# EAGLE design PCB-BI8-2x5RGB-SE-VC (EAGLE 7.1.0)

## Sheet 1 of 2
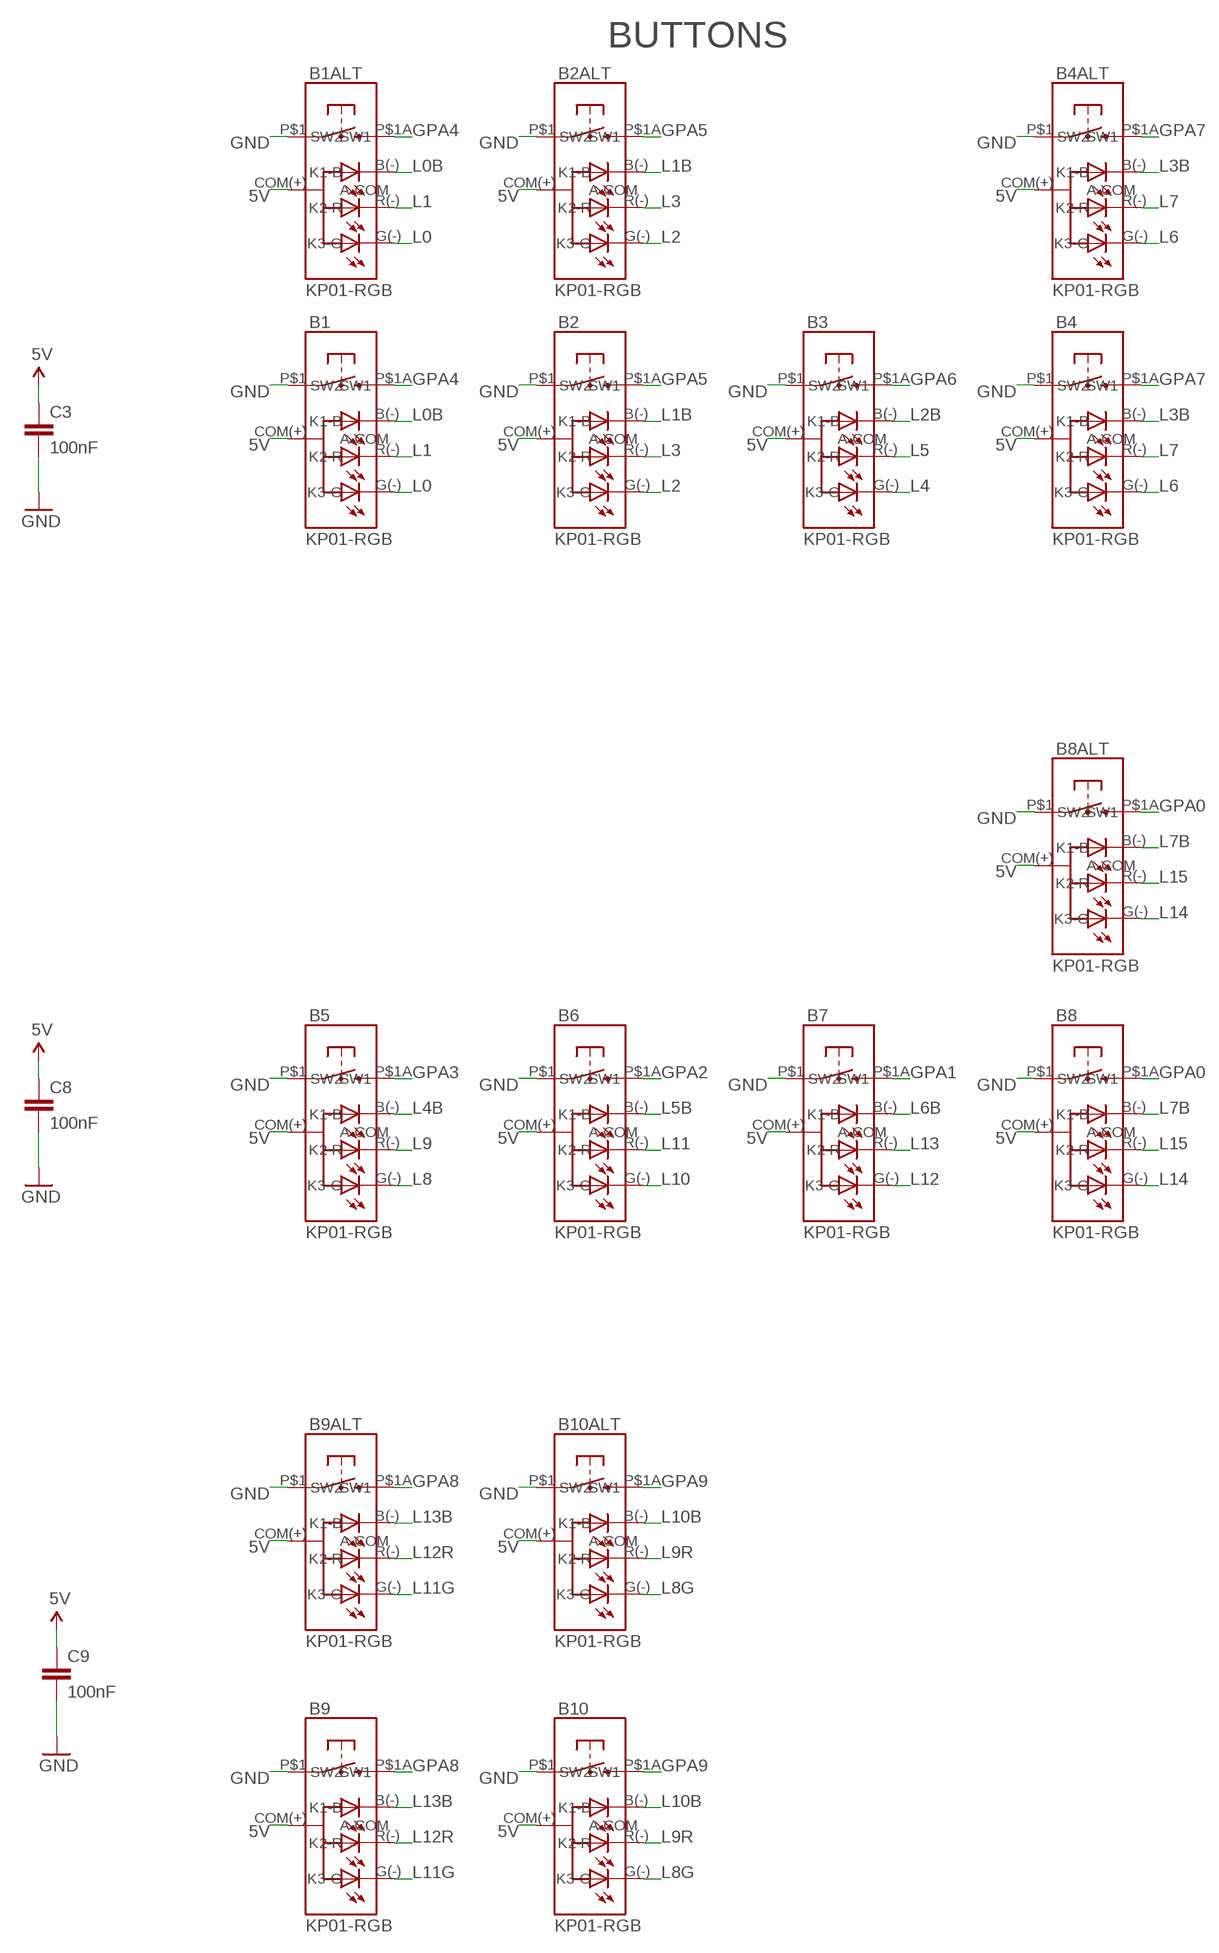
[diagram p0: schematic, sheet 1, part 1 of 2]
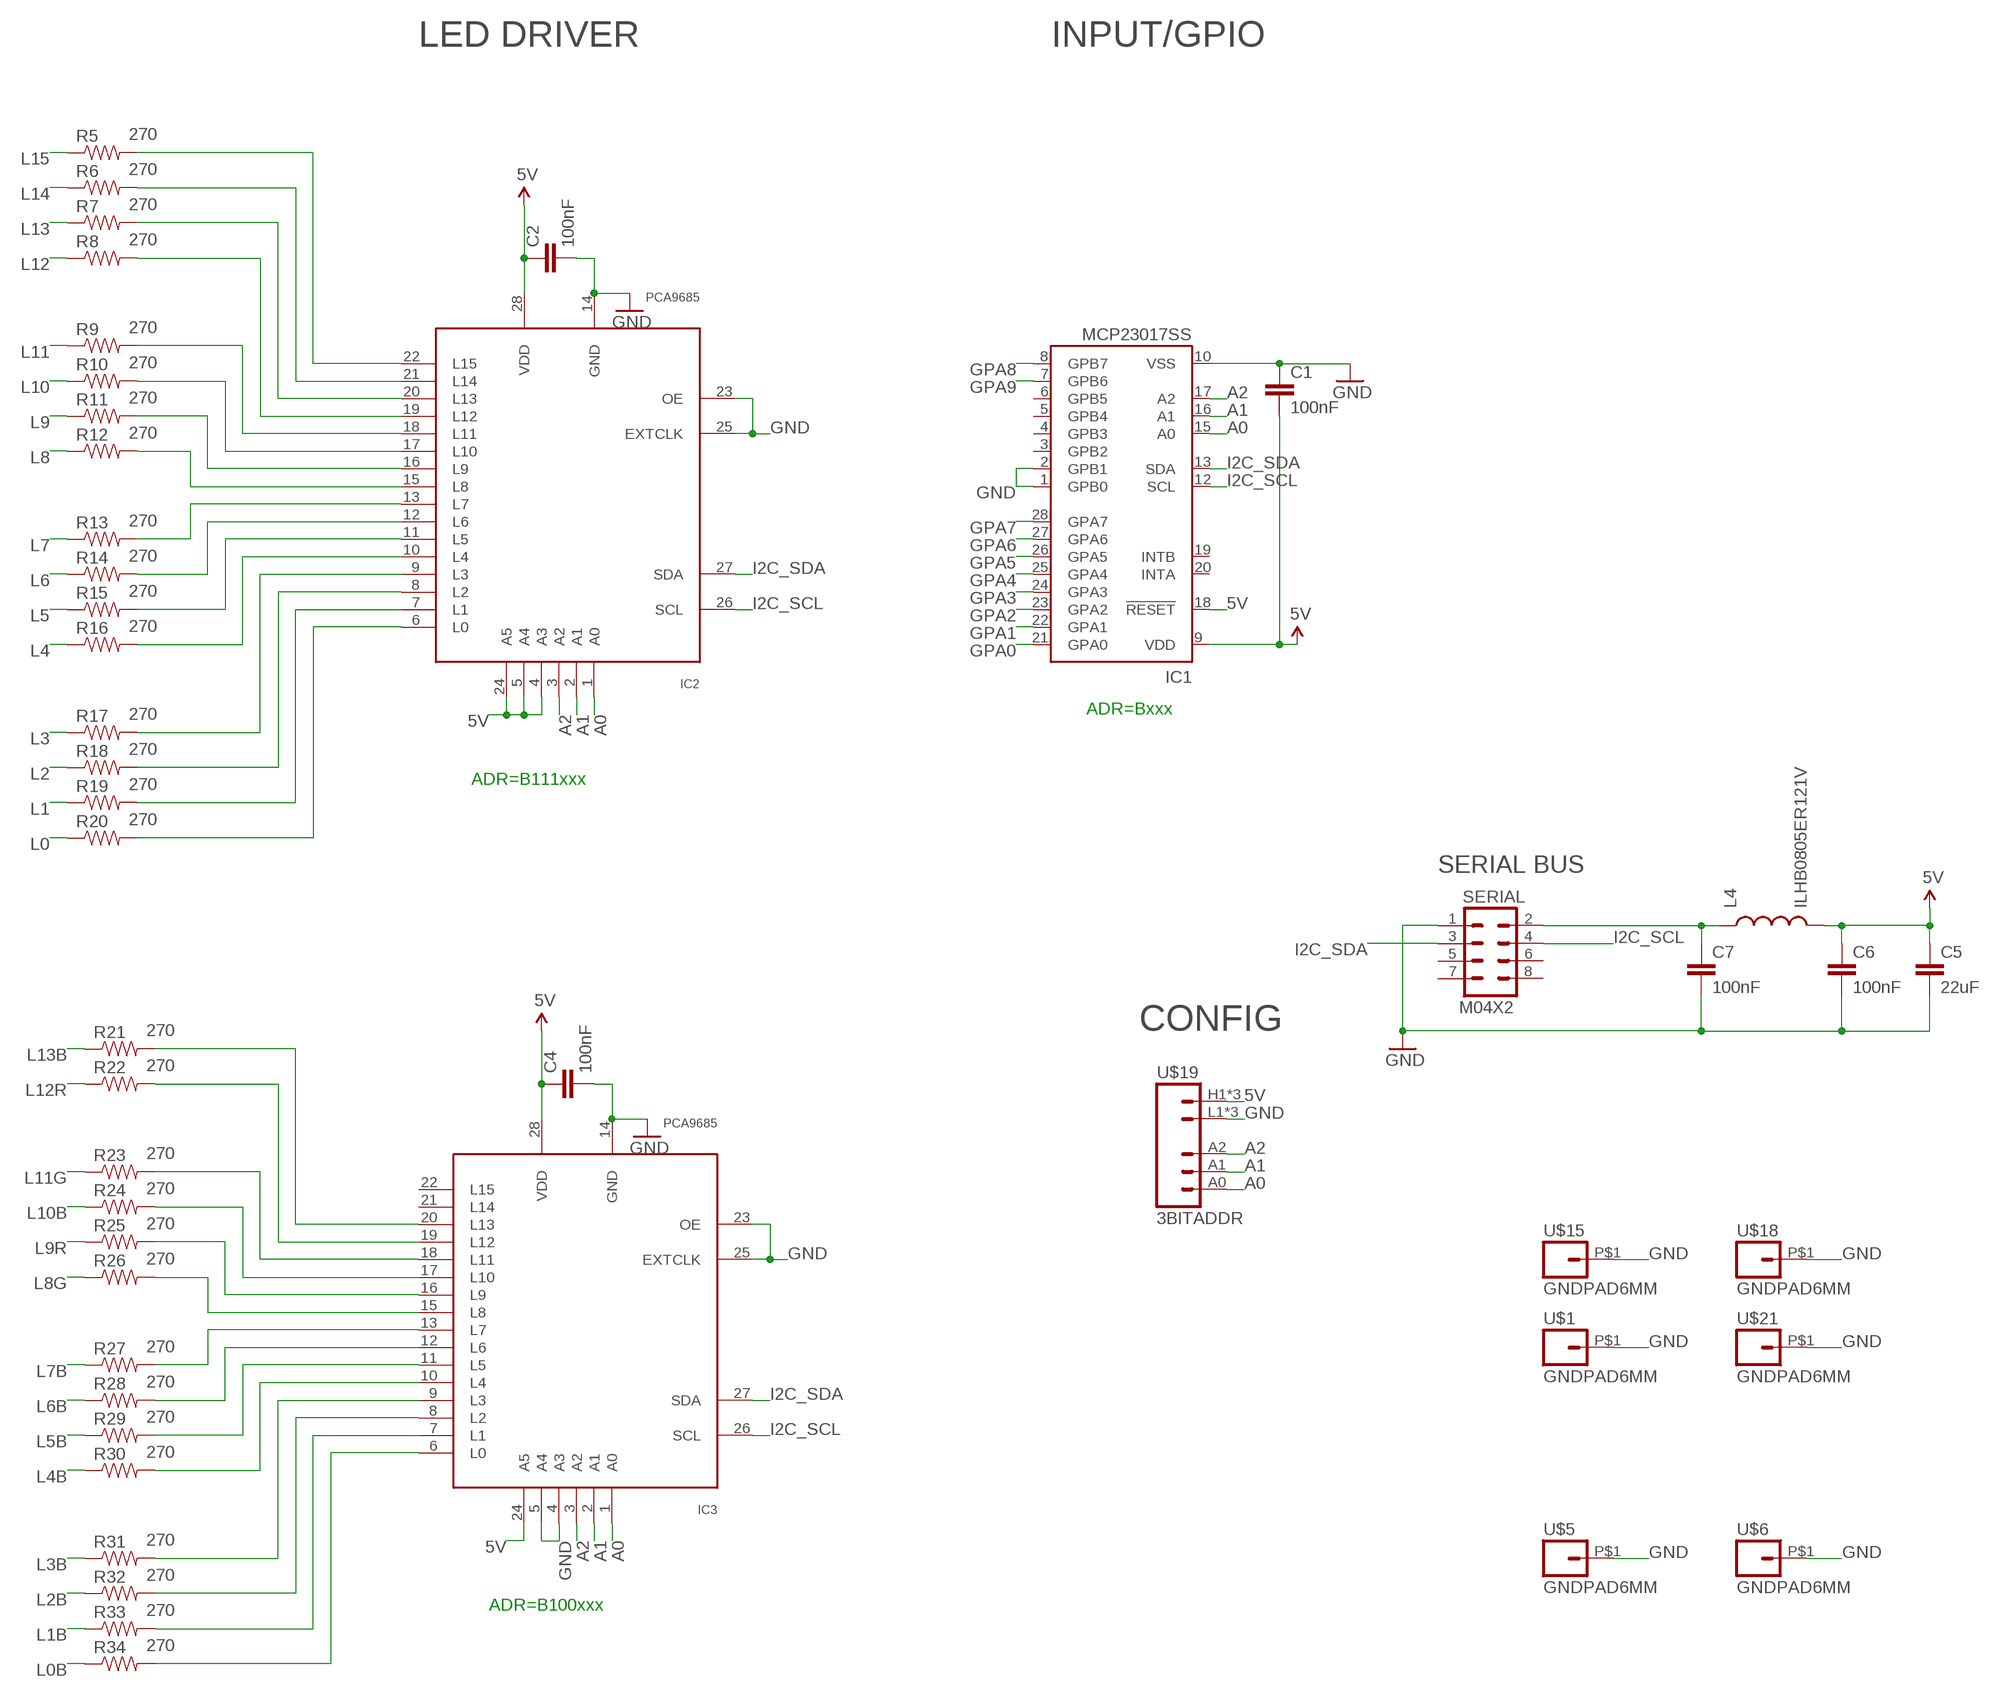
[diagram p1: schematic, sheet 1, part 2 of 2]

### Parts
B1  KP01-RGB  NKK-KP01  [NKK-KP01]
B1ALT  KP01-RGB  NKK-KP01  [NKK-KP01]
B2  KP01-RGB  NKK-KP01  [NKK-KP01]
B2ALT  KP01-RGB  NKK-KP01  [NKK-KP01]
B3  KP01-RGB  NKK-KP01  [NKK-KP01]
B4  KP01-RGB  NKK-KP01  [NKK-KP01]
B4ALT  KP01-RGB  NKK-KP01  [NKK-KP01]
B5  KP01-RGB  NKK-KP01  [NKK-KP01]
B6  KP01-RGB  NKK-KP01  [NKK-KP01]
B7  KP01-RGB  NKK-KP01  [NKK-KP01]
B8  KP01-RGB  NKK-KP01  [NKK-KP01]
B8ALT  KP01-RGB  NKK-KP01  [NKK-KP01]
B9  KP01-RGB  NKK-KP01  [NKK-KP01]
B9ALT  KP01-RGB  NKK-KP01  [NKK-KP01]
B10  KP01-RGB  NKK-KP01  [NKK-KP01]
B10ALT  KP01-RGB  NKK-KP01  [NKK-KP01]
C1  100nF  CAP0603-CAP  [0603-CAP]
C2  100nF  CAP0603-CAP  [0603-CAP]
C3  100nF  CAP0603-CAP  [0603-CAP]
C4  100nF  CAP0603-CAP  [0603-CAP]
C5  22uF  CAP0805  [0805]
C6  100nF  CAP0603-CAP  [0603-CAP]
C7  100nF  CAP0603-CAP  [0603-CAP]
C8  100nF  CAP0603-CAP  [0603-CAP]
C9  100nF  CAP0603-CAP  [0603-CAP]
IC1  MCP23017SS  [SSOP28]
IC2  PCA9685  [TSSOP28]
IC3  PCA9685  [TSSOP28]
L4  ILHB0805ER121V  INDUCTOR0805  [0805]
R5  270  RESISTOR0603-RES  [0603-RES]
R6  270  RESISTOR0603-RES  [0603-RES]
R7  270  RESISTOR0603-RES  [0603-RES]
R8  270  RESISTOR0603-RES  [0603-RES]
R9  270  RESISTOR0603-RES  [0603-RES]
R10  270  RESISTOR0603-RES  [0603-RES]
R11  270  RESISTOR0603-RES  [0603-RES]
R12  270  RESISTOR0603-RES  [0603-RES]
R13  270  RESISTOR0603-RES  [0603-RES]
R14  270  RESISTOR0603-RES  [0603-RES]
R15  270  RESISTOR0603-RES  [0603-RES]
R16  270  RESISTOR0603-RES  [0603-RES]
R17  270  RESISTOR0603-RES  [0603-RES]
R18  270  RESISTOR0603-RES  [0603-RES]
R19  270  RESISTOR0603-RES  [0603-RES]
R20  270  RESISTOR0603-RES  [0603-RES]
R21  270  RESISTOR0603-RES  [0603-RES]
R22  270  RESISTOR0603-RES  [0603-RES]
R23  270  RESISTOR0603-RES  [0603-RES]
R24  270  RESISTOR0603-RES  [0603-RES]
R25  270  RESISTOR0603-RES  [0603-RES]
R26  270  RESISTOR0603-RES  [0603-RES]
R27  270  RESISTOR0603-RES  [0603-RES]
R28  270  RESISTOR0603-RES  [0603-RES]
R29  270  RESISTOR0603-RES  [0603-RES]
R30  270  RESISTOR0603-RES  [0603-RES]
R31  270  RESISTOR0603-RES  [0603-RES]
R32  270  RESISTOR0603-RES  [0603-RES]
R33  270  RESISTOR0603-RES  [0603-RES]
R34  270  RESISTOR0603-RES  [0603-RES]
SERIAL  M04X2  [2X4]
U$1  GNDPAD6MM  [3.2MMPAD6MM]
U$5  GNDPAD6MM  [3.2MMPAD6MM]
U$6  GNDPAD6MM  [3.2MMPAD6MM]
U$15  GNDPAD6MM  [3.2MMPAD6MM]
U$18  GNDPAD6MM  [3.2MMPAD6MM]
U$19  3BITADDR  [3BITADDR]
U$21  GNDPAD6MM  [3.2MMPAD6MM]

### Nets
5V [Power]: B1.COM(+)(A-COM) B1ALT.COM(+)(A-COM) B2.COM(+)(A-COM) B2ALT.COM(+)(A-COM) B3.COM(+)(A-COM) B4.COM(+)(A-COM) B4ALT.COM(+)(A-COM) B5.COM(+)(A-COM) B6.COM(+)(A-COM) B7.COM(+)(A-COM) B8.COM(+)(A-COM) B8ALT.COM(+)(A-COM) B9.COM(+)(A-COM) B9ALT.COM(+)(A-COM) B10.COM(+)(A-COM) B10ALT.COM(+)(A-COM) C1.2 C2.1 C3.1 C4.1 C5.1 C6.1 C8.1 C9.1 IC1.9(VDD) IC1.18(!RESET) IC2.4(A3) IC2.5(A4) IC2.24(A5) IC2.28(VDD) IC3.24(A5) IC3.28(VDD) L4.2 U$19.H1(VCC) U$19.H2(VCC) U$19.H3(VCC)
A0: IC1.15(A0) IC2.1(A0) IC3.1(A0) U$19.A0
A1: IC1.16(A1) IC2.2(A1) IC3.2(A1) U$19.A1
A2: IC1.17(A2) IC2.3(A2) IC3.3(A2) U$19.A2
GND [Power]: B1.P$1(SW1) B1ALT.P$1(SW1) B2.P$1(SW1) B2ALT.P$1(SW1) B3.P$1(SW1) B4.P$1(SW1) B4ALT.P$1(SW1) B5.P$1(SW1) B6.P$1(SW1) B7.P$1(SW1) B8.P$1(SW1) B8ALT.P$1(SW1) B9.P$1(SW1) B9ALT.P$1(SW1) B10.P$1(SW1) B10ALT.P$1(SW1) C1.1 C2.2 C3.2 C4.2 C5.2 C6.2 C7.2 C8.2 C9.2 IC1.1(GPB0) IC1.2(GPB1) IC1.10(VSS) IC2.14(GND) IC2.23(OE) IC2.25(EXTCLK) IC3.4(A3) IC3.5(A4) IC3.14(GND) IC3.23(OE) IC3.25(EXTCLK) SERIAL.1 U$1.P$1 U$5.P$1 U$6.P$1 U$15.P$1 U$18.P$1 U$19.L1(GND) U$19.L2(GND) U$19.L3(GND) U$21.P$1
GPA0: B8.P$1A(SW2) B8ALT.P$1A(SW2) IC1.21(GPA0)
GPA1: B7.P$1A(SW2) IC1.22(GPA1)
GPA2: B6.P$1A(SW2) IC1.23(GPA2)
GPA3: B5.P$1A(SW2) IC1.24(GPA3)
GPA4: B1.P$1A(SW2) B1ALT.P$1A(SW2) IC1.25(GPA4)
GPA5: B2.P$1A(SW2) B2ALT.P$1A(SW2) IC1.26(GPA5)
GPA6: B3.P$1A(SW2) IC1.27(GPA6)
GPA7: B4.P$1A(SW2) B4ALT.P$1A(SW2) IC1.28(GPA7)
GPA8: B9.P$1A(SW2) B9ALT.P$1A(SW2) IC1.8(GPB7)
GPA9: B10.P$1A(SW2) B10ALT.P$1A(SW2) IC1.7(GPB6)
I2C_SCL: IC1.12(SCL) IC2.26(SCL) IC3.26(SCL) SERIAL.4
I2C_SDA: IC1.13(SDA) IC2.27(SDA) IC3.27(SDA) SERIAL.3
L0: B1.G(-)(K3-G) B1ALT.G(-)(K3-G) R20.1
L0B: B1.B(-)(K1-B) B1ALT.B(-)(K1-B) R34.1
L1: B1.R(-)(K2-R) B1ALT.R(-)(K2-R) R19.1
L1B: B2.B(-)(K1-B) B2ALT.B(-)(K1-B) R33.1
L2: B2.G(-)(K3-G) B2ALT.G(-)(K3-G) R18.1
L2B: B3.B(-)(K1-B) R32.1
L3: B2.R(-)(K2-R) B2ALT.R(-)(K2-R) R17.1
L3B: B4.B(-)(K1-B) B4ALT.B(-)(K1-B) R31.1
L4: B3.G(-)(K3-G) R16.1
L4B: B5.B(-)(K1-B) R30.1
L5: B3.R(-)(K2-R) R15.1
L5B: B6.B(-)(K1-B) R29.1
L6: B4.G(-)(K3-G) B4ALT.G(-)(K3-G) R14.1
L6B: B7.B(-)(K1-B) R28.1
L7: B4.R(-)(K2-R) B4ALT.R(-)(K2-R) R13.1
L7B: B8.B(-)(K1-B) B8ALT.B(-)(K1-B) R27.1
L8: B5.G(-)(K3-G) R12.1
L8G: B10.G(-)(K3-G) B10ALT.G(-)(K3-G) R26.1
L9: B5.R(-)(K2-R) R11.1
L9R: B10.R(-)(K2-R) B10ALT.R(-)(K2-R) R25.1
L10: B6.G(-)(K3-G) R10.1
L10B: B10.B(-)(K1-B) B10ALT.B(-)(K1-B) R24.1
L11: B6.R(-)(K2-R) R9.1
L11G: B9.G(-)(K3-G) B9ALT.G(-)(K3-G) R23.1
L12: B7.G(-)(K3-G) R8.1
L12R: B9.R(-)(K2-R) B9ALT.R(-)(K2-R) R22.1
L13: B7.R(-)(K2-R) R7.1
L13B: B9.B(-)(K1-B) B9ALT.B(-)(K1-B) R21.1
L14: B8.G(-)(K3-G) B8ALT.G(-)(K3-G) R6.1
L15: B8.R(-)(K2-R) B8ALT.R(-)(K2-R) R5.1
N$1 [Power]: C7.1 L4.1 SERIAL.2
N$2: IC3.13(L7) R27.2
N$3: IC3.12(L6) R28.2
N$4: IC2.13(L7) R13.2
N$5: IC2.12(L6) R14.2
N$6: IC3.11(L5) R29.2
N$7: IC2.11(L5) R15.2
N$9: IC2.10(L4) R16.2
N$10: IC2.9(L3) R17.2
N$11: IC2.8(L2) R18.2
N$12: IC2.7(L1) R19.2
N$13: IC3.10(L4) R30.2
N$14: IC3.9(L3) R31.2
N$15: IC3.8(L2) R32.2
N$16: IC3.7(L1) R33.2
N$17: IC3.6(L0) R34.2
N$18: IC3.15(L8) R26.2
N$19: IC2.6(L0) R20.2
N$20: IC2.15(L8) R12.2
N$21: IC2.16(L9) R11.2
N$22: IC2.17(L10) R10.2
N$23: IC2.18(L11) R9.2
N$24: IC2.19(L12) R8.2
N$25: IC2.20(L13) R7.2
N$26: IC2.21(L14) R6.2
N$27: IC2.22(L15) R5.2
N$28: IC3.16(L9) R25.2
N$29: IC3.17(L10) R24.2
N$30: IC3.18(L11) R23.2
N$31: IC3.19(L12) R22.2
N$32: IC3.20(L13) R21.2
Unconnected: IC1.3(GPB2) IC1.4(GPB3) IC1.5(GPB4) IC1.6(GPB5) IC1.19(INTB) IC1.20(INTA) IC3.21(L14) IC3.22(L15) SERIAL.5 SERIAL.6 SERIAL.7 SERIAL.8

### Notes on the sheet
- BUTTONS | LED DRIVER | INPUT/GPIO
- ADR=Bxxx
- ADR=B111xxx
- SERIAL BUS
- CONFIG
- ADR=B100xxx

## Sheet 2 of 2

## Library data of the parts
B1 B1ALT B2 B2ALT B3 B4 B4ALT B5-B8 B8ALT B9 B9ALT B10 B10ALT = SKAARHOJ:NKK-KP01: NKK-KP01-15AC 100mA12VDC
C1-C9 = SparkFun:CAP: Capacitor Standard 0603 ceramic capacitor, and 0.1" leaded capacitor.
IC1 = microchip:MCP23017: http://ww1.microchip.com/downloads/en/DeviceDoc/21952a.pdf Source: http://ww1.microchip.com/downloads/en/DeviceDoc/21952a.pdf; MF: MICROCHIP; MPN: MCP23017-E/SS; OC_FARNELL: 1467674; OC_NEWARK: 31K2960
IC2 IC3 = wsmith:PCA9685
L4 = SparkFun:INDUCTOR: Inductors Basic Inductor/Choke - 0603 and 1206. Footprints are not proven and vary greatly between part numbers.
R5-R34 = SparkFun:RESISTOR: Resistor Basic schematic elements and footprints for 0603, 1206, and PTH resistors.
SERIAL = SparkFun:M04X2
U$1 U$5 U$6 U$15 U$18 U$21 = SKAARHOJ:GNDPAD
U$19 = SKAARHOJ:3BITADDR

## Net classes
0 default: width 0.203 mm, drill 0.254 mm, clearance 0.203 mm
1 Power: width 0.406 mm, drill 0.61 mm, clearance 0.203 mm

## Board
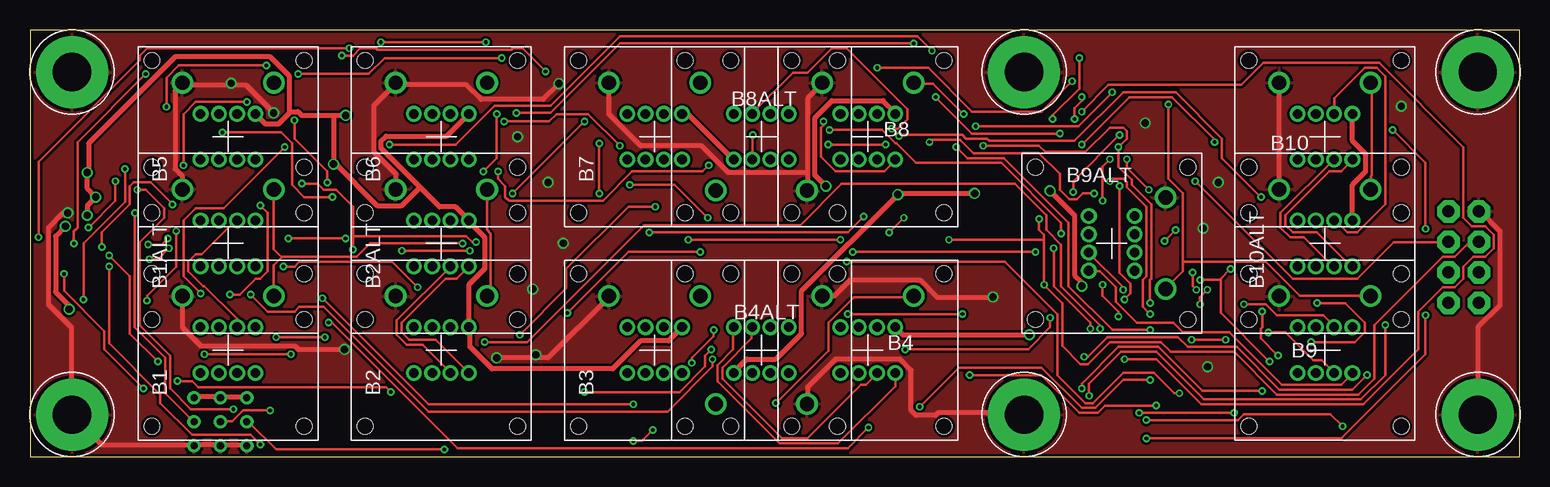
[diagram p2: board, top side]
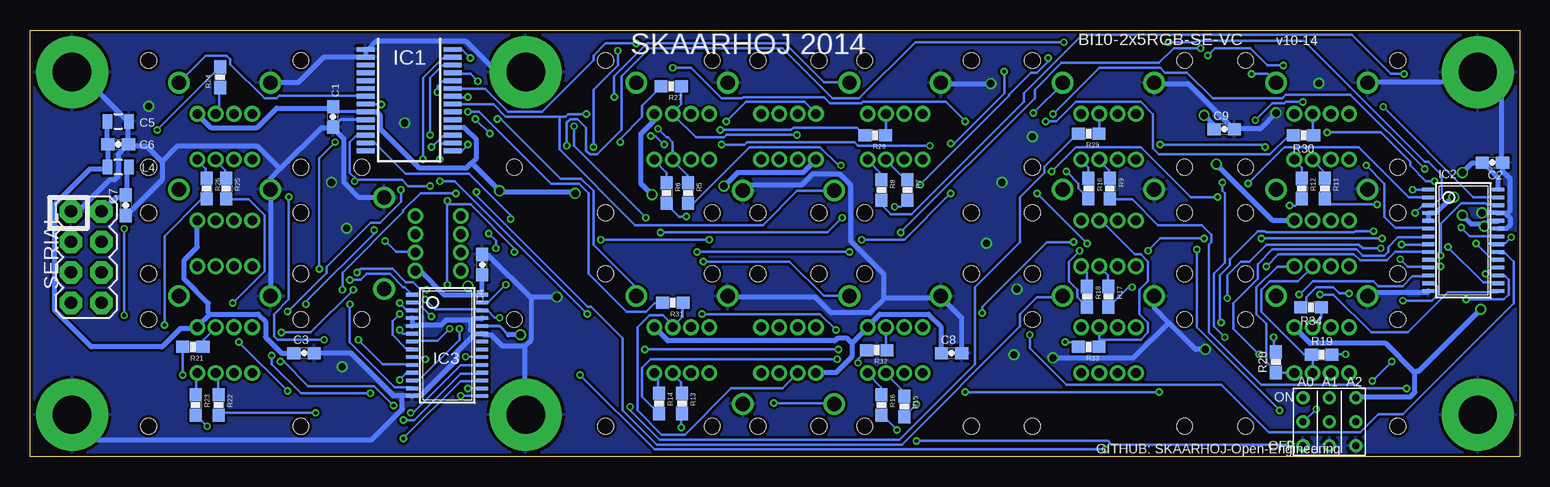
[diagram p3: board, bottom side, seen from below]

Size 124.19 x 35.56 mm. Coordinates in mm from the lower left corner, seen from the top.
Outline: 0,0 124.19,0 124.19,35.56 0,35.56 0,0
Copper layers (1*16): Top 0.035mm / dielectric 1.5mm / Bottom 0.035mm
Design rules "Fusion_eagle_rule_v1.1": minimum track width 6mil, minimum drill 12mil, track to track 6mil, track to pad 6mil, pad to pad 6mil, via to via 6mil, smd to smd 0mil, copper to edge 10mil, drill to drill 10mil, minimum pad ring 10mil, minimum via ring 6mil, stop-mask expansion 2mil, vias tented up to drill 100mil, thermal gap 10mil

### Footprints (pad centres in the part's own frame; a part is rotated, then mirrored left to right if it is on the bottom)
NKK-KP01 = drill 0.8: B(-) 1.905,-0.762; COM(+) 1.905,-2.286; G(-) -1.905,-2.286; P$3 1.905,0.762; P$4 1.905,2.286; P$7 -1.905,0.762; P$8 -1.905,2.286; R(-) -1.905,-0.762 | drill 1.2: P$1 4.496,3.81; P$1A 4.496,-3.81 | hole 1.3: -6.35,6.35; 6.35,6.35; 6.35,-6.35; -6.35,-6.35
0603-CAP = smd 1.1 x 1: 1 -0.85,0; 2 0.85,0
0805 = smd 0.8 x 1.2: 1 -0.9,0; 2 0.9,0
SSOP28 = smd 0.4 x 1.5: 1 -4.225,-3.625; 2 -3.575,-3.625; 3 -2.925,-3.625; 4 -2.275,-3.625; 5 -1.625,-3.625; 6 -0.975,-3.625; 7 -0.325,-3.625; 8 0.325,-3.625; 9 0.975,-3.625; 10 1.625,-3.625; 11 2.275,-3.625; 12 2.925,-3.625; 13 3.575,-3.625; 14 4.225,-3.625; 15 4.225,3.625; 16 3.575,3.625; 17 2.925,3.625; 18 2.275,3.625; 19 1.625,3.625; 20 0.975,3.625; 21 0.325,3.625; 22 -0.325,3.625; 23 -0.975,3.625; 24 -1.625,3.625; 25 -2.275,3.625; 26 -2.925,3.625; 27 -3.575,3.625; 28 -4.225,3.625
TSSOP28 = smd 0.305 x 0.991: 1 -4.225,-2.918; 2 -3.575,-2.918; 3 -2.925,-2.918; 4 -2.275,-2.918; 5 -1.625,-2.918; 6 -0.975,-2.918; 7 -0.325,-2.918; 8 0.325,-2.918; 9 0.975,-2.918; 10 1.625,-2.918; 11 2.275,-2.918; 12 2.925,-2.918; 13 3.575,-2.918; 14 4.225,-2.918; 15 4.225,2.918; 16 3.575,2.918; 17 2.925,2.918; 18 2.275,2.918; 19 1.625,2.918; 20 0.975,2.918; 21 0.325,2.918; 22 -0.325,2.918; 23 -0.975,2.918; 24 -1.625,2.918; 25 -2.275,2.918; 26 -2.925,2.918; 27 -3.575,2.918; 28 -4.225,2.918
0603-RES = smd 1.1 x 1: 1 -0.85,0; 2 0.85,0
2X4 = drill 1.016 pad 1.88 octagon: 1 -3.81,-1.27; 2 -3.81,1.27; 3 -1.27,-1.27; 4 -1.27,1.27; 5 1.27,-1.27; 6 1.27,1.27; 7 3.81,-1.27; 8 3.81,1.27
3.2MMPAD6MM = drill 3.2 pad 6: P$1 0,0
3BITADDR = drill 0.6: A0 -2.2,0; A1 0,0; A2 2.2,0; H1 -2.2,2; H2 0,2; H3 2.2,2; L1 -2.2,-2; L2 0,-2; L3 2.2,-2

### Placement (x,y rotation side)
B1  16.51,8.89 90 top
B1ALT  16.51,17.78 90 top
B2  34.29,8.89 90 top
B2ALT  34.29,17.78 90 top
B3  52.07,8.89 90 top
B4  69.85,8.89 90 top
B4ALT  60.96,8.89 270 top
B5  16.51,26.67 90 top
B6  34.29,26.67 90 top
B7  52.07,26.67 90 top
B8  69.85,26.67 90 top
B8ALT  60.96,26.67 270 top
B9  107.95,8.89 90 top
B9ALT  90.17,17.78 0 top
B10  107.95,26.67 90 top
B10ALT  107.95,17.78 90 top
C1  98.93,28.32 90 bottom
C2  2.29,24.51 0 bottom
C3  101.35,8.64 0 bottom
C4  86.49,16 90 bottom
C5  116.84,27.94 0 bottom
C6  116.84,26.04 0 bottom
C7  116.2,20.95 270 bottom
C8  47.37,8.64 0 bottom
C9  24.64,27.3 0 bottom
IC1  92.58,29.72 270 bottom
IC2  4.7,18.03 270 bottom
IC3  89.41,9.27 270 bottom
L4  116.84,24.13 180 bottom
R5  69.34,21.97 270 bottom
R6  71.12,21.97 270 bottom
R7  51.05,22.23 270 bottom
R8  53.21,22.23 270 bottom
R9  34.16,22.35 270 bottom
R10  35.94,22.35 270 bottom
R11  16.26,22.35 270 bottom
R12  18.16,22.35 270 bottom
R13  69.85,4.45 270 bottom
R14  71.75,4.45 270 bottom
R15  51.31,4.19 270 bottom
R16  53.21,4.32 270 bottom
R17  34.29,13.34 270 bottom
R18  36.07,13.34 270 bottom
R19  16.51,8.51 0 bottom
R20  20.32,7.87 90 bottom
R21  110.62,9.14 180 bottom
R22  108.46,4.32 270 bottom
R23  110.36,4.32 270 bottom
R24  108.33,31.62 90 bottom
R25  107.82,22.35 270 bottom
R26  109.47,22.35 270 bottom
R27  70.74,30.86 180 bottom
R28  53.72,26.8 180 bottom
R29  35.94,26.92 180 bottom
R30  18.03,26.8 180 bottom
R31  70.61,12.83 180 bottom
R32  53.59,8.89 180 bottom
R33  35.94,9.14 180 bottom
R34  17.4,12.45 180 bottom
SERIAL  119.51,16.64 270 bottom
U$1  3.5,3.5 0 top
U$5  120.69,32.06 0 top
U$6  120.69,3.5 0 top
U$15  3.5,32.06 0 top
U$18  82.86,32.06 0 top
U$19  15.88,2.92 0 bottom
U$21  82.86,3.5 0 top

### Tracks (layer width: path | path; a pad name or v marks a point on that pad's centre or on a via)
5V  (via drill 0.61)
  Top 0.406: 32.51,22.45 34.14,20.83 35.46,20.83 36.47,19.81 B2ALT.COM(+) 36.58,19.61 37.9,18.29 37.9,15.65 36.58,14.33 B2.COM(+) 36.68,10.67 36.68,9.14 38.51,7.32 48.56,7.32 50.9,9.65 53.24,9.65 54.36,10.77 B3.COM(+) | 32.51,22.45 29.26,25.7 29.26,26.31 29.67,26.72 34.75,26.72 36.58,28.55 B6.COM(+) | U$19.H3 13.72,4.98 15.85,4.98 U$19.H2 16.05,4.98 17.98,4.98 U$19.H1 | v4.78,20.12 4.78,20.93 v5.49,21.64 4.78,22.35 v4.78,23.67 4.88,23.77 4.88,26.11 12.09,33.33 20.02,33.33 21.64,31.7 21.64,28.85 21.74,28.75 | 25.3,28.45 22.66,28.45 22.35,28.75 21.74,28.75 | 25.3,28.45 v26.31,28.45 | 21.74,28.75 20.73,27.74 19.61,27.74 18.8,28.55 B5.COM(+) | 25.3,28.45 v25.3,24.38 25.4,24.49 28.96,20.93 30.99,20.93 32.51,22.45 | v3.25,12.29 3.25,12.6 2.13,13.72 2.13,18.39 v2.95,19.2 | v87.68,14.22 87.68,14.53 87.07,15.14 87.07,20.12 v85.04,22.15 | B10.COM(+) 110.24,26.31 111.35,25.2 111.35,23.77 110.24,22.66 B10ALT.COM(+) | B7.COM(+) 54.36,28.55 54.86,28.55 58.62,24.79 B8ALT.COM(+) | v66.34,22.55 65.43,23.47 65.43,28.25 66.85,29.67 71.12,29.67 72.14,28.65 B8.COM(+) | v83.31,10.16 72.75,10.16 72.14,10.77 B4.COM(+) | B4ALT.COM(+) 58.62,7.01 59.74,8.13 62.18,8.13 64.31,10.26 64.31,13.82 v72.34,21.84 72.44,21.95 v78.74,21.95
  Bottom 0.254: IC1.9 98.5,28.74 C1.2 | IC3.24 85.06,10.9 84.33,10.16
  Bottom 0.406: 8.74,7.01 11.18,9.45 17.48,9.45 18.8,10.77 B1.COM(+) | 8.74,7.01 8.74,5.38 9.14,4.98 13.61,4.98 U$19.H3 | IC2.28 1.83,22.35 1.83,23.27 3.05,24.49 C2.1 3.35,24.49 3.96,24.49 v4.78,23.67 | 2.95,19.41 4.06,19.41 v4.78,20.12 | 2.95,19.41 2.74,19.41 2.54,19.61 1.83,19.61 IC2.24 | v5.49,21.64 5.69,21.64 7.01,20.32 7.52,20.32 IC2.4 7.62,20.12 7.62,19.71 IC2.5 | v26.31,28.45 25.5,27.64 25.5,27.33 C9.1 | v25.3,24.38 20.62,19.71 18.8,19.71 B1ALT.COM(+) | v3.25,12.29 8.43,7.11 8.64,7.11 8.74,7.01 | v2.95,19.2 2.95,19.41 | C4.1 86.56,15.14 86.56,13.51 IC3.28 86.77,13.51 87.68,13.51 | 87.68,13.51 89.71,13.51 91.64,15.44 92.05,15.44 B9ALT.COM(+) | 87.38,24.49 87.78,24.08 91.75,24.08 95,27.33 95,28.45 95.3,28.75 96.11,28.75 IC1.9 | 87.38,24.49 86.97,24.89 86.97,26.42 87.99,27.43 88.9,27.43 IC1.18 | v87.68,14.22 87.68,13.51 | 87.38,24.49 v85.04,22.15 84.94,22.05 78.84,22.05 v78.74,21.95 | C5.1 117.75,27.94 117.75,26.21 C6.1 117.65,26.01 117.65,24.18 L4.2 117.86,23.98 119.18,23.98 122.12,21.03 122.12,12.19 119.08,9.14 113.18,9.14 111.66,10.67 110.34,10.67 B9.COM(+) 110.24,10.87 109.22,11.89 | C3.1 103.23,8.64 104.55,9.96 104.55,11.28 105.16,11.89 109.22,11.89 | B10ALT.COM(+) 110.24,17.48 111.35,16.36 111.35,14.83 109.32,12.8 109.32,11.99 109.22,11.89 | C1.2 98.96,29.06 103.63,29.06 105.26,27.43 109.12,27.43 110.24,28.55 B10.COM(+) | v66.34,22.55 65.23,23.67 59.74,23.67 58.73,24.69 B8ALT.COM(+) | v83.31,10.16 84.33,10.16 | C8.1 48.26,8.64 48.26,10.87 49.28,11.89 53.34,11.89 54.36,10.87 B3.COM(+) 54.46,10.67 55.68,9.45 | 55.68,9.45 55.68,8.33 57,7.01 58.62,7.01 B4ALT.COM(+)
  Bottom 0.406: 55.68,9.45 56.08,9.86 56.9,9.86 57.1,9.65 71.02,9.65 72.14,10.77 B4.COM(+) | B8.COM(+) 72.14,28.04 73.25,26.92 73.25,22.76 v72.34,21.84
A0  (via drill 0.3)
  Top 0.203: v97.54,14.73 99.16,14.73 99.21,14.78 | v100.08,15.65 99.21,14.78 | v98.75,26.21 98.75,26.42 95.2,29.97 91.64,29.97 v87.68,26.01 | v8.94,22.25 9.65,22.25 11.18,20.73 11.18,19.91 9.14,17.88 9.14,10.97 11.68,8.43 11.68,5.69 13.41,3.96 v16.97,3.96 | v103.33,7.92 99.26,11.99 99.26,14.73 99.21,14.78 | v93.88,4.27 89.61,4.27 89,3.66 87.48,3.66 84.33,6.81 v78.33,6.81 | v34.54,0.61 20.52,0.61 18.29,2.85 18.09,2.85 U$19.A0
  Bottom 0.203: v97.54,14.73 96.62,14.73 96.11,15.24 94.18,15.24 93.07,14.12 92.96,14.12 92.35,13.51 IC3.1 | v100.08,15.65 100.08,24.89 v98.75,26.21 | v87.68,26.01 88.19,25.5 88.9,25.5 IC1.15 | v8.94,22.25 IC2.1 | v16.97,3.96 17.98,2.95 U$19.A0 | v103.33,7.92 103.02,7.92 100.99,5.89 95.5,5.89 v93.88,4.27 | v78.33,6.81 72.14,0.61 v34.54,0.61
A1  (via drill 0.3)
  Top 0.203: v90.73,11.68 90.73,12.09 89.41,13.41 v89.41,14.33 | v89.41,21.34 89.41,24.18 v90.02,24.79 | v22.66,22.76 23.98,22.76 24.49,22.25 25.5,22.25 26.92,20.83 26.92,18.39 | v26.92,17.27 26.92,18.39 | v20.02,3.86 17.78,3.86 16.87,2.95 15.95,2.95 U$19.A1 | v68.58,17.07 v83.82,17.07 | v55.88,17.07 49.89,17.07 v44.81,11.99 | v37.19,17.88 36.88,17.88 36.37,18.39 26.92,18.39
  Bottom 0.203: v90.73,11.68 91.85,12.8 92.25,12.8 IC3.2 | v89.41,21.34 89.41,21.03 | 89.41,21.03 v89.41,14.33 | v90.02,24.79 90.02,25.91 89.81,26.11 89,26.11 IC1.16 | v22.66,22.76 19.61,25.81 13.41,25.81 9.25,21.64 7.62,21.64 IC2.2 | v26.92,17.27 26.92,10.77 v20.02,3.86 | 89.41,21.03 87.48,21.03 83.82,17.37 v83.82,17.07 | v55.88,17.07 v68.58,17.07 | v44.81,11.99 44.81,12.5 39.42,17.88 v37.19,17.88
A2  (via drill 0.3)
  Top 0.203: v93.37,12.8 93.37,14.73 93.47,14.83 93.47,21.03 91.85,22.66 91.85,23.06 90.73,24.18 v90.73,25.81 91.44,26.52 91.44,27.13 91.14,27.43 90.02,27.43 87.99,25.4 84.63,25.4 84.12,25.91 v79.45,25.91 | v8.74,20.32 8.74,10.77 11.28,8.23 11.28,5.28 13.61,2.95 U$19.A2 | v29.26,34.54 v38,34.54
  Bottom 0.203: v93.37,12.8 92.86,12.29 92.35,12.29 IC3.3 | v90.73,25.81 89.81,26.72 89,26.72 IC1.17 | v8.74,20.32 8.13,20.93 7.62,20.93 IC2.3 7.52,21.03 7.11,21.03 6.5,21.64 6.5,23.47 7.62,24.59 7.92,24.59 17.98,34.65 26.92,34.65 27.03,34.54 v29.26,34.54 | v79.45,25.91 79.45,27.84 79.15,28.14 78.54,28.14 77.83,27.43 77.83,25.5 77.52,25.2 76.91,25.2 74.88,27.23 74.88,31.7 72.54,34.04 61.47,34.04 57.3,29.87 55.07,29.87 50.39,34.54 v38,34.54
GND  (via drill 0.6, 0.61)
  Top 0.406: B10ALT.P$1 B10.P$1 | U$21.P$1 82.7,3.66 75.69,3.66 75.49,3.45 73.86,3.45 73.46,3.86 73.46,7.21 72.54,8.13 67.16,8.13 64.82,5.79 64.82,4.47 B4ALT.P$1 | U$6.P$1 120.7,3.56 120.7,10.77 122.53,12.6 122.53,18.8 120.8,20.52 SERIAL.1 | U$19.L1 17.98,1.02 16.05,1.02 U$19.L2 15.85,1.02 13.72,1.02 U$19.L3 13.51,1.02 5.99,1.02 3.56,3.45 U$1.P$1 3.45,3.66 3.45,10.77 1.52,12.7 1.52,19.1 2.74,20.32 v3.15,20.32 | B2ALT.P$1 30.48,23.57 28.65,25.4 28.65,29.26 30.48,31.09 B6.P$1 30.58,30.99 36.37,30.99 37.59,29.77 42.77,29.77 v44.09,31.09 | B1ALT.P$1 12.7,23.37 12.09,23.98 12.09,30.48 12.7,31.09 B5.P$1 12.8,30.99 17.98,30.99 v20.32,28.65 | v26.21,8.94 22.35,8.94 22.05,9.25 14.22,9.25 12.7,10.77 B1.P$1 | 64.82,23.67 64.82,29.87 66.04,31.09 B8.P$1 | 64.82,23.67 64.82,22.25 B8ALT.P$1 | B7.P$1 48.26,28.55 50.9,25.91 55.98,25.91 58.22,23.67 64.82,23.67 | v38.91,8.23 43.18,8.23 48.26,13.31 B3.P$1 | v80.26,13.31 75.59,13.31 74.17,14.73 68.38,14.73 67.06,13.41 66.04,13.41 B4.P$1
  Bottom 0.254: IC1.10 98.31,28.09 C1.1
  Bottom 0.406: B10.P$1 104.14,31.19 101.8,31.19 99.67,33.33 96.42,33.33 IC1.2 96.22,33.33 IC1.1 96.01,33.93 95.3,34.65 87.88,34.65 85.34,32.11 82.91,32.11 U$18.P$1 | 103.33,23.98 104.14,23.16 B10ALT.P$1 B9.P$1 | 103.33,23.98 99.87,27.43 98.96,27.43 C1.1 98.86,27.33 98.04,26.52 98.04,22.86 96.83,21.64 94.69,21.64 B9ALT.P$1 | IC3.4 92.35,11.48 92.35,10.97 IC3.5 92.15,10.97 89.92,10.97 89.51,11.38 87.48,11.38 87.38,11.28 | 87.17,10.26 86.56,10.26 IC3.23 86.36,10.16 85.75,10.16 84.84,9.25 82.91,9.25 | 87.17,10.26 87.48,10.57 87.48,11.18 87.38,11.28 | 87.38,11.28 87.17,11.48 86.56,11.48 IC3.25 | 87.17,10.26 87.17,10.16 88.59,8.74 88.59,8.13 91.64,5.08 92.25,5.08 IC3.14 92.46,5.08 93.17,5.08 | 82.4,13.21 85.95,16.76 86.46,16.76 C4.2 | 82.4,13.21 82.4,9.75 82.91,9.25 | C3.2 97.43,8.64 93.88,5.08 93.17,5.08 | 82.91,9.25 82.91,3.56 U$21.P$1 | C6.2 116.03,26.11 116.03,27.94 C5.2 116.13,28.04 120.09,32 120.6,32 U$5.P$1 | 113.18,24.59 113.18,23.06 116.13,20.12 C7.2 | 113.18,24.59 114.5,25.91 115.82,25.91 C6.2 | SERIAL.1 120.7,20.52 120.09,20.52 117.55,23.06 117.14,23.06 116.84,23.37 116.84,25.2 116.13,25.91 C6.2 | 93.17,5.08 93.17,3.96 95.71,1.42 118.57,1.42 120.6,3.45 U$6.P$1 | 103.33,23.98 105.26,25.91 111.86,25.91 113.18,24.59 | B6.P$1 30.48,31.09 27.64,31.09 23.88,27.33 C9.2 23.57,27.33 21.64,27.33 v20.32,28.65 | 1.12,20.22 1.22,20.32 1.73,20.32 IC2.25 1.93,20.32 v3.15,20.32 | 1.12,20.22 0.81,19.91 0.81,19.3 1.12,19 1.73,19 IC2.23 | 1.12,20.22 0.81,20.52 0.81,23.16 1.42,23.77 1.42,24.49 C2.2 1.52,24.69 1.52,30.07 3.45,32 U$15.P$1 3.66,32 4.47,31.19 12.7,31.19 B5.P$1
  Bottom 0.406: IC2.14 7.62,13.72 12.39,13.72 12.7,13.41 B1.P$1 | B2.P$1 30.48,12.39 29.26,11.18 | 29.26,11.18 27.03,8.94 v26.21,8.94 | C8.2 46.53,8.64 46.53,11.58 48.26,13.31 B3.P$1 48.36,13.21 52.93,13.21 | 52.93,13.21 54.15,11.99 57.4,11.99 58.73,13.31 66.04,13.31 B4.P$1 | 52.93,13.21 53.03,13.31 53.03,15.24 55.78,17.98 55.78,22.66 56.69,23.57 58.93,23.57 59.84,22.66 64.31,22.66 64.72,22.25 B8ALT.P$1 | 29.26,11.18 32.21,8.23 v38.91,8.23 | v44.09,31.09 48.26,31.09 B7.P$1 | v80.26,13.31 82.3,13.31 82.4,13.21
  other vias: 42.16,8.51 40.64,26.67 44.45,17.78 92.96,27.81 98.17,7.49 41.91,13.97 43.18,22.86 97.79,19.05 99.06,22.86 114.3,29.21 16.76,31.11
  pour Bottom: 0,0 124.46,0 124.46,35.56 0,35.56
  pour Top: 0,0 124.46,0 124.46,35.56 0,35.56
GPA0  (via drill 0.3)
  Top 0.203: v77.83,28.55 75.29,31.09 73.66,31.09 B8.P$1A
  Bottom 0.203: 80.06,28.35 79.55,28.35 79.35,28.55 v77.83,28.55 | 80.06,28.35 84.53,28.35 85.55,29.36 88.9,29.36 IC1.21 | 80.06,28.35 80.06,25.6 73.76,19.3 63.09,19.3 60.25,22.15 57.2,22.15 B8ALT.P$1A
GPA1  (via drill 0.3)
  Top 0.203: v87.68,29.97 87.68,29.67 87.07,29.06 v87.07,28.14 | v85.85,26.92 78.54,26.92 v75.49,29.97
  Bottom 0.203: v87.68,29.97 88.9,29.97 IC1.22 | v85.85,26.92 v87.07,28.14 | v75.49,29.97 75.49,31.7 72.75,34.44 61.27,34.44 58.01,31.19 55.88,31.19 B7.P$1A
GPA2  (via drill 0.3)
  Top 0.203: v73.66,34.44 49.17,34.44 43.38,28.65 v40.54,28.65
  Bottom 0.203: v73.66,34.44 76.2,34.44 77.22,33.43 77.22,33.02 81.48,28.75 84.33,28.75 86.26,30.68 88.9,30.68 IC1.23 | v40.54,28.65 38.1,31.09 B6.P$1A
GPA3  (via drill 0.3)
  Top 0.203: v90.22,30.38 87.38,27.53 v78.84,27.53 | v71.63,18.69 v72.85,19.91 | v56.49,19.91 53.75,22.66 v49.99,22.66 | v39.32,33.22 29.57,33.22 28.25,31.9 v22.35,31.9
  Bottom 0.203: v90.22,30.38 90.22,30.89 89.81,31.29 89,31.29 IC1.24 | v78.84,27.53 78.84,25.91 v72.85,19.91 | v71.63,18.69 57.71,18.69 v56.49,19.91 | v49.99,22.66 42.57,30.07 42.57,30.18 40.74,32 40.23,32 39.32,32.92 v39.32,33.22 | v22.35,31.9 21.03,31.9 20.32,31.19 B5.P$1A
GPA4  (via drill 0.3)
  Top 0.203: v86.87,31.29 84.33,28.75 78.54,28.75 74.88,32.41 v70.61,32.41 | v40.23,21.95 v46.23,27.94 | v36.07,17.78 28.35,17.78 27.23,16.66 21.03,16.66 20.98,16.61 | 20.98,16.61 20.32,15.95 B1.P$1A | B1ALT.P$1A 20.32,17.27 20.98,16.61
  Bottom 0.203: v86.87,31.29 87.48,31.9 88.9,31.9 IC1.25 | v70.61,32.41 69.09,32.41 66.55,29.87 64.82,29.87 64.72,29.97 58.01,29.97 57.51,29.46 54.86,29.46 54.76,29.57 47.85,29.57 v46.23,27.94 | v36.07,17.78 v40.23,21.95
GPA5  (via drill 0.3)
  Top 0.203: v90.83,26.82 86.97,22.96 v86.97,22.05 | B2ALT.P$1A 38.1,18.9 38.41,18.59 38.41,13.72 38.1,13.41 B2.P$1A
  Bottom 0.203: v90.83,26.82 90.83,31.6 89.81,32.61 89,32.61 IC1.26 | v86.97,22.05 86.97,21.74 77.72,12.5 77.42,12.5 74.78,9.86 74.78,3.86 71.93,1.02 51.51,1.02 41.66,10.87 41.66,11.89 40.23,13.31 38.1,13.31 B2.P$1A
GPA6  (via drill 0.3)
  Top 0.203: v91.44,24.79 91.44,24.08 v93.27,22.25 | v102.72,12.09 102.72,10.77 102.62,10.67 102.62,9.86 v104.04,8.43 | v95.81,5.28 95.4,5.28 93.67,7.01 91.14,7.01 88.59,4.47 87.99,4.47 85.65,6.81 85.65,11.89 81.28,16.26 v68.07,16.26
  Bottom 0.203: v91.44,24.79 91.44,31.6 89.81,33.22 89,33.22 IC1.27 | v93.27,22.25 93.27,21.23 95,19.51 95.81,19.51 99.47,15.85 99.47,15.34 v102.72,12.09 | v104.04,8.43 104.04,7.72 101.6,5.28 v95.81,5.28 | v68.07,16.26 60.86,16.26 58.01,13.41 55.88,13.41 B3.P$1A
GPA7  (via drill 0.3)
  Top 0.203: v87.48,33.22 87.48,30.68 85.24,28.45 v85.24,28.14 | v62.18,4.47 66.55,8.84 66.55,11.18 68.68,13.31 73.66,13.31 B4.P$1A
  Bottom 0.203: v87.48,33.22 88.19,33.93 88.9,33.93 IC1.28 | v85.24,28.14 84.94,28.14 79.96,23.16 78.23,23.16 77.22,22.15 77.22,17.68 73.66,14.12 B4.P$1A | v62.18,4.47 57.2,4.47 B4ALT.P$1A
GPA8  (via drill 0.3)
  Top 0.203: v94.89,29.36 94.89,23.16 96.11,21.95 96.11,16.26 | 96.11,16.26 96.11,15.44 94.69,14.02 B9ALT.P$1A | 96.11,16.26 103.02,16.26 105.87,13.41 111.76,13.41 B9.P$1A
  Bottom 0.203: v94.89,29.36 96.11,29.36 IC1.8
GPA9
  Top 0.203: B10ALT.P$1A 111.76,23.37 111.86,23.47 111.86,30.99 111.76,31.09 B10.P$1A
  Bottom 0.203: IC1.7 96.22,30.07 103.43,30.07 103.63,29.87 104.65,29.87 107.49,32.72 107.49,33.12 107.8,33.43 109.53,33.43 111.76,31.19 B10.P$1A
I2C_SCL  (via drill 0.3)
  Top 0.203: v91.24,13.11 91.75,13.61 91.75,14.43 90.83,15.34 v90.83,22.55 | v6.6,16.76 8.33,15.04 8.33,10.26 v10.67,7.92 | v12.29,6.3 13.51,6.3 14.02,5.79 29.67,5.79 v30.07,5.38 | v46.23,5.38 54.15,5.38 56.29,7.52 56.29,8.43 v56.79,8.94 | v72.95,8.94 83.21,8.94 85.04,10.77 v85.04,11.58 | v97.13,22.96 105.26,14.83 110.64,14.83 113.69,17.88 118.16,17.88 SERIAL.4
  Bottom 0.203: v91.24,13.11 90.42,12.29 86.56,12.29 IC3.26 86.46,12.19 86.06,12.19 85.45,11.58 v85.04,11.58 | v90.83,22.55 92.66,22.55 93.17,23.06 96.93,23.06 96.98,23.11 | 96.98,23.11 97.54,23.67 97.54,26.21 97.03,26.72 96.22,26.72 IC1.12 | v6.6,16.76 6.6,19.41 4.88,21.13 2.85,21.13 2.74,21.03 1.83,21.03 IC2.26 | v12.29,6.3 v10.67,7.92 | v46.23,5.38 v30.07,5.38 | v72.95,8.94 v56.79,8.94 | 96.98,23.11 v97.13,22.96
I2C_SDA  (via drill 0.3)
  Top 0.203: 84.53,18.09 84.53,18.49 84.12,18.9 v84.12,19.81 | 84.53,18.09 v84.53,14.33 86.06,12.8 86.06,9.25 87.58,7.72 88.19,7.72 90.02,9.55 94.28,9.55 95.1,8.74 100.38,8.74 103.94,5.18 110.74,5.18 112.06,6.5 112.06,10.97 117.75,16.66 118.77,16.66 119.99,17.88 120.7,17.88 SERIAL.3 | v11.38,29.16 11.38,31.6 12.39,32.61 v19.71,32.61 | v26.01,33.43 26.92,33.43 27.53,34.04 28.85,34.04 28.96,33.93 40.13,33.93 40.23,34.04 41.05,34.04 v42.98,32.11 | v47.45,21.95 v47.45,26.11 | v67.56,18.09 v54.86,18.09 | 84.53,18.09 v76.61,18.09
  Bottom 0.203: v84.53,14.33 85.95,12.9 86.46,12.9 IC3.27 | v84.12,19.81 84.12,20.12 87.58,23.57 92.86,23.57 95.4,26.11 96.11,26.11 IC1.13 | v11.38,29.16 3.86,21.64 1.83,21.64 IC2.27 | v19.71,32.61 21.03,32.61 22.45,34.04 25.4,34.04 v26.01,33.43 | v42.98,32.11 42.98,30.28 47.14,26.11 v47.45,26.11 | v47.45,21.95 51.31,18.09 v54.86,18.09 | v76.61,18.09 v67.56,18.09
L0
  Bottom 0.203: B1.G(-) 18.8,7.01 R20.1 20.32,7.11 21.13,7.92 21.13,11.07 21.95,11.89 21.95,14.12 20.22,15.85 18.8,15.85 B1ALT.G(-)
L0B
  Top 0.203: B1.B(-) 17.27,11.48 14.53,14.22 14.43,14.22 13.21,15.44 13.21,16.26 13.82,16.87 14.33,16.87 17.07,19.61 17.27,19.61 B1ALT.B(-)
  Bottom 0.203: R34.1 16.56,12.39 16.56,11.58 17.27,10.87 B1.B(-)
L1
  Bottom 0.203: B1.R(-) 17.27,8.43 R19.1 17.37,8.53 17.98,8.53 21.54,12.09 21.54,13.92 20.83,14.63 18.49,14.63 17.27,15.85 B1ALT.R(-)
L1B
  Bottom 0.203: B2.B(-) 35.05,9.75 | 35.05,9.75 35.05,9.14 R33.1 | 35.05,9.75 31.6,9.75 30.99,10.36 30.99,11.18 31.7,11.89 31.7,13.92 30.99,14.63 30.99,16.26 31.6,16.87 32.11,16.87 34.85,19.61 35.05,19.61 B2ALT.B(-)
L2
  Top 0.203: B2.G(-) 36.58,7.01 33.83,9.75 31.6,9.75 30.99,10.36 30.99,11.18 34.65,14.83 35.56,14.83 36.58,15.85 B2ALT.G(-)
  Bottom 0.203: R18.1 36.07,15.34 36.58,15.85 B2ALT.G(-)
L2B
  Bottom 0.203: B3.B(-) 52.83,8.94 R32.1
L3
  Top 0.203: B2.R(-) 35.05,7.01 32.72,9.35 31.39,9.35 30.58,10.16 30.58,11.38 35.05,15.85 B2ALT.R(-)
  Bottom 0.203: R17.1 34.34,14.22 34.34,15.14 35.05,15.85 B2ALT.R(-)
L3B
  Bottom 0.203: R31.1 69.8,12.8 69.8,11.68 70.61,10.87 B4.B(-) 70.61,10.97 71.42,11.79 72.54,11.79 73.56,10.77 73.56,3.86 71.53,1.83 69.6,1.83 65.73,5.69 61.47,5.69 60.25,6.91 B4ALT.B(-)
L4
  Bottom 0.203: R16.1 53.24,5.18 53.24,5.79 54.36,6.91 B3.G(-)
L4B
  Bottom 0.203: B5.B(-) 17.27,26.82 R30.1
L5
  Bottom 0.203: R15.1 51.31,5.38 52.83,6.91 B3.R(-)
L5B
  Bottom 0.203: B6.B(-) 35.05,26.92 R29.1
L6
  Top 0.203: B4.G(-) 72.14,5.89 67.36,1.12 62.48,1.12 57.3,6.3 57.3,7.62 58.62,8.94 58.62,10.77 B4ALT.G(-)
  Bottom 0.203: R14.1 71.83,5.38 71.83,6.6 72.14,6.91 B4.G(-)
L6B
  Bottom 0.203: B7.B(-) 52.83,26.82 R28.1
L7
  Top 0.203: B4ALT.R(-) 60.15,10.77 60.15,9.86 57.71,7.42 57.71,6.5 62.69,1.52 64.82,1.52 69.29,5.99 69.7,5.99 70.61,6.91 B4.R(-)
  Bottom 0.203: R13.1 69.9,5.38 69.9,6.2 70.61,6.91 B4.R(-)
L7B  (via drill 0.3)
  Top 0.203: v60.25,26.82 60.25,24.79 B8ALT.B(-)
  Bottom 0.203: R27.1 69.9,30.79 69.9,29.36 70.61,28.65 B8.B(-) 70.61,28.55 68.68,26.62 66.34,26.62 66.14,26.82 v60.25,26.82
L8
  Bottom 0.203: R12.1 18.19,23.27 18.19,24.08 18.8,24.69 B5.G(-)
L8G
  Top 0.203: B10ALT.G(-) 110.24,15.95 110.03,15.95 107.29,18.69 105.26,18.69 104.65,19.3 104.65,20.12 108.31,23.77 109.32,23.77 110.24,24.69 B10.G(-)
  Bottom 0.203: R26.1 109.53,23.27 109.53,23.98 110.24,24.69 B10.G(-)
L9
  Bottom 0.203: R11.1 16.26,23.67 17.27,24.69 B5.R(-)
L9R
  Top 0.203: B10ALT.R(-) 108.71,15.95 108.51,15.95 106.17,18.29 105.05,18.29 104.24,19.1 104.24,20.32 108.71,24.79 B10.R(-)
  Bottom 0.203: R25.1 107.9,23.27 107.9,23.88 108.71,24.69 B10.R(-)
L10
  Bottom 0.203: R10.1 35.97,23.27 35.97,24.08 36.58,24.69 B6.G(-)
L10B
  Top 0.203: B10.B(-) 108.71,29.87 111.25,32.41 112.27,32.41 112.98,31.7 112.98,21.03 110.64,18.69 109.83,18.69 108.92,19.61 108.71,19.61 B10ALT.B(-)
  Bottom 0.203: R24.1 108.41,30.68 108.41,28.96 108.71,28.65 B10.B(-)
L11
  Bottom 0.203: R9.1 34.24,23.27 34.24,23.88 35.05,24.69 B6.R(-)
L11G
  Top 0.203: B9ALT.G(-) 88.29,15.44 89.2,15.44 90.53,14.12 90.53,12.9 92.25,11.18 95.3,11.18 96.11,10.36 99.97,10.36 104.34,5.99 109.32,5.99 110.24,6.91 B9.G(-)
  Bottom 0.203: R23.1 110.34,5.18 110.34,6.81 110.24,6.91 B9.G(-)
L12
  Bottom 0.203: R8.1 53.24,23.16 53.24,23.57 54.36,24.69 B7.G(-)
L12R  (via drill 0.3)
  Top 0.203: v91.14,13.92 91.14,14.12 88.29,16.97 B9ALT.R(-) | v96.93,15.34 96.93,14.22 v97.23,13.92 | v103.23,10.36 104.65,10.36 106.98,8.03 107.7,8.03 108.71,7.01 B9.R(-)
  Bottom 0.203: R22.1 108.51,5.18 108.51,6.71 108.71,6.91 B9.R(-) | v91.14,13.92 91.64,13.92 92.25,14.53 92.86,14.53 93.98,15.65 96.62,15.65 v96.93,15.34 | v97.23,13.92 100.79,10.36 v103.23,10.36
L13
  Bottom 0.203: R7.1 51.1,23.16 51.31,23.16 52.83,24.69 B7.R(-)
L13B  (via drill 0.3)
  Top 0.203: v95.5,18.9 v94.59,17.98 | v101.19,12.7 103.02,12.7 103.94,11.79 107.8,11.79 108.71,10.87 B9.B(-)
  Bottom 0.203: R21.1 109.73,9.14 109.73,9.75 108.71,10.77 B9.B(-) | v94.59,17.98 93.67,17.07 92.15,17.07 B9ALT.B(-) | v95.5,18.9 95.5,18.59 101.19,12.9 v101.19,12.7
L14  (via drill 0.3)
  Top 0.203: v66.14,27.94 66.14,27.64 65.94,27.43 65.94,24.99 67.16,23.77 71.22,23.77 72.14,24.69 B8.G(-)
  Bottom 0.203: R6.1 71.12,23.67 72.14,24.69 B8.G(-) | v66.14,27.94 64.52,29.57 59.64,29.57 58.73,28.65 B8ALT.G(-)
L15  (via drill 0.3)
  Top 0.203: v71.83,27.33 72.34,27.33 73.15,28.14 73.15,28.96 68.07,34.04 66.85,34.04 64.82,32 63.6,32 60.25,28.65 B8ALT.R(-)
  Bottom 0.203: R5.1 69.39,22.86 69.39,23.47 70.61,24.69 B8.R(-) 70.61,26.21 71.02,26.62 71.12,26.62 v71.83,27.33
N$1
  Bottom 0.406: L4.1 116.03,24.08 116.13,23.98 116.13,21.84 C7.1 116.33,21.64 117.04,21.64 SERIAL.2
N$2  (via drill 0.3)
  Top 0.203: v97.54,12.7 97.54,13.31 v98.15,13.92 | v88.7,21.95 87.78,21.95 87.27,21.44 86.67,21.44 85.85,22.25 85.85,23.57 84.12,25.3 78.64,25.3 77.52,26.42 75.18,26.42 v74.98,26.21
  Bottom 0.203: v97.54,12.7 97.54,9.55 93.78,5.79 92.35,5.79 IC3.13 | v98.15,13.92 98.15,15.34 93.07,20.42 93.07,20.52 91.64,21.95 v88.7,21.95 | v74.98,26.21 74.98,26.52 73.15,28.35 73.15,29.26 71.63,30.79 R27.2
N$3  (via drill 0.3)
  Top 0.203: v88.39,10.67 88.39,11.18 85.34,14.22 v85.34,17.37 | v85.95,18.59 85.95,19.51 80.97,24.49 73.86,24.49 72.24,26.11 72.14,26.11 71.02,27.23 v66.65,27.23
  Bottom 0.203: v88.39,10.67 88.39,9.75 91.75,6.4 92.25,6.4 IC3.12 | v85.34,17.37 85.34,17.98 v85.95,18.59 | v66.65,27.23 60.76,27.23 60.55,27.43 55.27,27.43 54.66,26.82 R28.2
N$4  (via drill 0.3)
  Top 0.203: v9.75,13.01 9.75,13.41 12.19,15.85 v12.19,18.8 | v24.89,11.18 25.2,11.18 35.66,0.71 68.17,0.71 v69.9,2.44
  Bottom 0.203: v9.75,13.01 7.32,13.01 6.81,13.51 6.81,14.12 7.11,14.43 7.52,14.43 IC2.13 | v12.19,18.8 13.72,18.8 13.82,18.69 21.13,18.69 21.23,18.8 21.84,18.8 24.18,16.46 24.18,15.95 24.99,15.14 24.99,11.28 v24.89,11.18 | v69.9,2.44 69.9,3.56 R13.2
N$5  (via drill 0.3)
  Top 0.203: v18.39,13.51 19.81,12.09 22.05,12.09 22.45,12.5 24.49,12.5 33.22,3.76 53.14,3.76 56.9,7.52 v56.9,8.13
  Bottom 0.203: v18.39,13.51 17.27,14.63 12.19,14.63 11.79,14.22 9.75,14.22 8.94,15.04 7.62,15.04 IC2.12 | v56.9,8.13 72.44,8.13 73.15,7.42 73.15,4.98 71.83,3.66 R14.2
N$6  (via drill 0.3)
  Top 0.203: v93.37,6.4 91.14,6.4 88.8,4.06 87.68,4.06 84.33,7.42 77.42,7.42 v74.17,4.17
  Bottom 0.203: v93.37,6.4 92.86,6.91 92.35,6.91 IC3.11 | v74.17,4.17 74.17,3.86 71.73,1.42 51.71,1.42 45.41,7.72 45.41,14.12 41.66,17.88 41.66,21.64 39.62,23.67 39.62,24.18 36.88,26.92 R29.2
N$7  (via drill 0.3)
  Top 0.203: v9.96,16.46 10.67,16.46 v11.58,17.37 | v24.38,13.21 33.22,4.37 v50.29,4.37
  Bottom 0.203: v9.96,16.46 9.35,15.85 7.62,15.85 IC2.11 | v11.58,17.37 13.11,17.37 13.41,17.68 21.13,17.68 22.55,16.26 23.27,16.26 24.38,15.14 v24.38,13.21 | v50.29,4.37 51.31,3.35 R15.2
N$9  (via drill 0.3)
  Top 0.203: v6.6,15.85 6.6,9.45 10.87,5.18 10.87,4.47 13.51,1.83 18.39,1.83 v19.2,1.02 | v50.29,1.32 51,1.32 v51.92,2.23
  Bottom 0.203: v6.6,15.85 7.11,16.36 7.52,16.36 IC2.10 | v19.2,1.02 34.04,1.02 34.34,1.32 v50.29,1.32 | v51.92,2.23 53.14,3.45 R16.2
N$10  (via drill 0.3)
  Top 0.203: v21.13,15.85 22.05,15.85 22.45,16.26 30.18,16.26 v32.31,14.12
  Bottom 0.203: v21.13,15.85 20.12,16.87 13.82,16.87 13.31,16.36 11.07,16.36 10.36,17.07 IC2.9 | v32.31,14.12 32.61,14.12 34.24,12.5 R17.2
N$11  (via drill 0.3)
  Top 0.203: v9.86,17.68 10.97,17.68 v11.48,18.19 | v26.31,18.19 v21.54,18.19 | v36.68,17.17 v30.99,17.17
  Bottom 0.203: v9.86,17.68 7.62,17.68 IC2.8 | v21.54,18.19 v11.48,18.19 | v26.31,18.19 29.97,18.19 v30.99,17.17 | v36.68,17.17 37.59,16.26 37.59,14.63 36.88,13.92 36.88,13.31 R18.2
N$12  (via drill 0.3)
  Top 0.203: v14.53,8.53 v21.74,8.53
  Bottom 0.203: v21.74,8.53 23.88,10.67 23.88,12.8 21.84,14.83 21.84,16.05 20.62,17.27 13.61,17.27 13.11,16.76 11.28,16.76 10.97,17.07 10.97,17.48 10.16,18.29 7.62,18.29 IC2.7 | v14.53,8.53 15.65,8.53 R19.2
N$13  (via drill 0.3)
  Top 0.203: v99.67,9.75 v96.83,9.75 | v102.62,21.64 99.36,24.89 99.36,26.52 95.5,30.38 91.14,30.38 87.07,26.31 79.96,26.31 79.76,26.52 78.03,26.52 77.72,26.82 72.54,26.82 v72.44,26.72 | v66.55,26.01 v71.32,26.01 | v49.17,25.91 46.53,28.55 43.89,28.55 43.28,27.94 v39.52,27.94
  Bottom 0.203: v96.83,9.75 94.79,7.72 92.35,7.72 IC3.10 | v99.67,9.75 103.53,9.75 103.83,10.06 103.83,11.89 102.62,13.11 v102.62,21.64 | v72.44,26.72 72.03,26.72 v71.32,26.01 | v66.55,26.01 64.62,26.01 64.41,26.21 55.47,26.21 55.17,25.91 v49.17,25.91 | v39.52,27.94 38.61,27.94 36.98,29.57 31.6,29.57 30.58,28.55 30.58,25.7 30.07,25.2 20.83,25.2 19.3,26.72 18.9,26.72 R30.2
N$14  (via drill 0.3)
  Top 0.203: v91.24,8.13 93.88,8.13 97.64,4.37 111.15,4.37 115.72,8.94 115.72,12.09 117.75,14.12 118.77,14.12 119.48,14.83 119.48,15.85 120.29,16.66 121.31,16.66 122.02,17.37 122.02,18.49 121.31,19.2 120.19,19.2 119.48,19.91 119.48,25.81 112.47,32.82 102.82,32.82 100.99,30.99 89.92,30.99 v87.68,28.75
  Bottom 0.203: v91.24,8.13 91.34,8.23 92.25,8.23 IC3.9 | v87.68,28.75 86.77,28.75 80.77,22.76 78.44,22.76 77.62,21.95 77.62,15.24 74.47,12.09 72.85,12.09 72.14,12.8 71.53,12.8 R31.2
N$15  (via drill 0.3)
  Top 0.203: v93.37,11.89 92.76,12.5 92.76,14.73 93.07,15.04 93.07,20.83 91.44,22.45 91.44,22.86 91.14,23.16 90.22,23.16 v90.02,22.96 | v68.17,11.89 v77.72,11.89 | v57,10.57 57,10.06 55.17,8.23 v55.17,7.82
  Bottom 0.203: v93.37,11.89 93.98,11.28 93.98,10.16 92.86,9.04 92.35,9.04 IC3.8 | v90.02,22.96 88.8,22.96 v77.72,11.89 | v68.17,11.89 58.32,11.89 v57,10.57 | v55.17,7.82 55.17,8.13 54.46,8.84 R32.2
N$16  (via drill 0.3)
  Top 0.203: v89.2,10.67 89.2,10.97 85.95,14.22 85.95,17.68 84.73,18.9 84.73,20.12 82.09,22.76 67.67,22.76 64.21,19.3 51.21,19.3 41.45,9.55 v37.9,9.55
  Bottom 0.203: v89.2,10.67 90.22,9.65 92.25,9.65 IC3.7 | v37.9,9.55 37.29,9.55 36.88,9.14 R33.2
N$17  (via drill 0.3)
  Top 0.203: v93.37,10.57 90.22,10.57 86.56,14.22 86.56,19.51 81.18,24.89 78.13,24.89 v77.22,25.81 | v75.18,33.83 73.97,35.05 49.17,35.05 43.38,29.26 38.71,29.26 35.46,26.01 v29.97,26.01 | v21.23,25.81 16.15,20.73 13.82,20.73 12.8,19.71 12.8,15.04 v14.22,13.61
  Bottom 0.203: v93.37,10.57 93.07,10.26 92.35,10.26 IC3.6 | v77.22,25.81 77.22,30.58 75.18,32.61 v75.18,33.83 | v29.97,26.01 21.44,26.01 v21.23,25.81 | v14.22,13.61 15.04,13.61 15.54,14.12 16.97,14.12 17.78,13.31 17.78,12.9 18.19,12.5 R34.2
N$18  (via drill 0.3)
  Top 0.203: v88.29,5.08 88.29,6.1 90.93,8.74 93.88,8.74 97.84,4.78 110.95,4.78 112.98,6.81 v112.98,10.97
  Bottom 0.203: v88.29,5.08 86.56,5.08 IC3.15 | v112.98,10.97 112.98,18.39 109.93,21.44 109.53,21.44 R26.2
N$19  (via drill 0.3)
  Top 0.203: v12.8,24.28 12.8,28.55 13.82,29.57 v18.09,29.57 | v22.05,28.04 22.05,26.52 24.79,23.77 v24.79,22.86 | v20.52,9.96 v24.59,9.96
  Bottom 0.203: v12.8,24.28 11.28,22.76 11.28,20.02 10.36,19.1 7.62,19.1 IC2.6 | v18.09,29.57 19.51,29.57 19.61,29.46 20.62,29.46 v22.05,28.04 | v24.79,22.86 24.79,22.15 24.59,21.95 24.59,16.15 25.5,15.24 25.5,10.87 v24.59,9.96 | v20.52,9.96 20.52,8.94 20.32,8.74 R20.2
N$20  (via drill 0.3)
  Top 0.203: v16.66,13.51 17.48,13.51 18.8,14.83 19.2,14.83 19.81,15.44 19.81,20.32 v19.2,20.93
  Bottom 0.203: v16.66,13.51 15.54,13.51 12.39,10.36 9.35,10.36 5.99,13.72 1.83,13.72 IC2.15 | v19.2,20.93 18.69,20.93 18.19,21.44 R12.2
N$21  (via drill 0.3)
  Top 0.203: v5.99,17.48 5.99,18.69 8.33,21.03 8.33,22.55 8.64,22.86 10.06,22.86 v11.89,21.03
  Bottom 0.203: v5.99,17.48 3.05,14.53 1.83,14.53 IC2.16 | v11.89,21.03 15.85,21.03 16.26,21.44 R11.2
N$22  (via drill 0.3)
  Top 0.203: v4.47,13.11 4.47,17.78 7.92,21.23 v7.92,23.98 | v38.91,28.55 38.91,24.89 v37.8,23.77
  Bottom 0.203: v4.47,13.11 1.32,13.11 0.91,13.51 0.91,14.73 1.22,15.04 1.73,15.04 IC2.17 | v7.92,23.98 14.12,30.18 19.51,30.18 19.81,29.87 25.6,29.87 27.74,32 29.57,32 29.97,32.41 35.05,32.41 v38.91,28.55 | v37.8,23.77 36.78,22.76 36.78,22.35 35.97,21.54 R10.2
N$23  (via drill 0.3)
  Top 0.203: v2.85,15.24 2.85,13.82 6.2,10.46 6.2,8.94 v9.45,5.69
  Bottom 0.203: v2.85,15.24 2.34,15.75 1.83,15.75 IC2.18 | v9.45,5.69 13.21,5.69 13.51,5.99 21.54,5.99 25.91,10.36 25.91,17.68 25.7,17.88 25.7,18.49 26.52,19.3 30.18,19.3 32.31,21.44 34.14,21.44 R9.2
N$24  (via drill 0.3)
  Top 0.203: v3.66,17.78 3.66,18.8 3.96,19.1 3.96,26.21 v9.65,31.9
  Bottom 0.203: v3.66,17.78 2.34,16.46 1.83,16.46 IC2.19 | v9.65,31.9 10.77,31.9 14.02,35.15 36.47,35.15 41.35,30.28 41.35,29.57 50.7,20.22 52.43,20.22 53.14,20.93 53.14,21.34 R8.2
N$25  (via drill 0.3)
  Top 0.203: v40.84,10.16 44.7,14.02 44.7,15.65 49.89,20.83 v52.12,20.83
  Bottom 0.203: v40.84,10.16 40.84,9.04 37.8,5.99 24.89,5.99 20.93,2.03 13.31,2.03 11.79,3.56 9.75,3.56 0.51,12.8 0.51,16.26 1.22,16.97 1.73,16.97 IC2.20 | v52.12,20.83 51.61,20.83 51.1,21.34 R7.2
N$26  (via drill 0.3)
  Top 0.203: v0.71,18.29 0.71,24.59 9.14,33.02 9.14,33.43 9.75,34.04 v26.62,34.04 | v51.61,18.69 68.17,18.69 v69.49,20.02
  Bottom 0.203: v0.71,18.29 1.22,17.78 1.73,17.78 IC2.21 | v26.62,34.04 28.85,34.04 30.07,32.82 38.2,32.82 40.44,30.58 40.44,29.87 v51.61,18.69 | v69.49,20.02 70.1,20.02 71.12,21.03 R6.2
  Bottom 0.254: IC2.21 2.47,17.71 2.54,17.78
N$27  (via drill 0.3)
  Top 0.203: v4.88,19.1 7.11,21.34 v7.11,22.96 | v16.05,27.03 20.93,27.03 21.84,26.11 21.84,22.66 22.86,21.64 v25.2,21.64 | v39.01,23.77 39.01,23.16 39.62,22.55 39.62,21.64 39.93,21.34 47.75,21.34 50.19,23.77 56.08,23.77 v56.59,24.28
  Bottom 0.203: v4.88,19.1 4.17,18.39 1.83,18.39 IC2.22 | v7.11,22.96 7.82,22.96 9.14,24.28 9.14,24.59 11.58,27.03 v16.05,27.03 | v25.2,21.64 27.43,21.64 31.6,25.81 36.98,25.81 v39.01,23.77 | v56.59,24.28 56.79,24.28 58.32,25.81 64.21,25.81 68.89,21.13 69.29,21.13 R5.2
N$28  (via drill 0.3)
  Top 0.203: v87.68,5.69 87.68,6.1 90.73,9.14 94.08,9.14 97.74,5.49 v102.72,5.49 | v106.78,9.55 110.44,9.55 111.25,10.36 111.25,11.18 109.63,12.8 v107.29,12.8
  Bottom 0.203: v87.68,5.69 86.56,5.69 IC3.16 | v106.78,9.55 v102.72,5.49 | v107.29,12.8 104.65,15.44 104.65,20.12 105.97,21.44 107.8,21.44 R25.2
N$29  (via drill 0.3)
  Top 0.203: v93.07,1.52 109.32,1.52 116.33,8.53 v116.33,11.79 | v116.33,19 116.33,24.49 v113.59,27.23
  Bottom 0.203: v93.07,1.52 88.29,6.3 86.56,6.3 IC3.17 | v116.33,19 v116.33,11.79 | v113.59,27.23 108.41,32.41 R24.2
N$30  (via drill 0.3)
  Top 0.203: v93.07,3.05 100.69,3.05 101.19,3.56 108.41,3.56 v109.42,2.54
  Bottom 0.203: v93.07,3.05 92.15,3.05 88.29,6.91 86.56,6.91 IC3.18 | v109.42,2.54 110.34,3.45 R23.2
N$31  (via drill 0.3)
  Top 0.203: v100.38,3.66 v92.46,3.66
  Bottom 0.203: v92.46,3.66 92.25,3.66 88.29,7.62 86.56,7.62 IC3.19 | v100.38,3.66 108.31,3.66 108.41,3.56 R22.2
N$32  (via drill 0.3)
  Top 0.203: v87.88,8.33 88.19,8.33 89.81,9.96 95.71,9.96 96.52,9.14 100.58,9.14 104.14,5.59 110.24,5.59 v111.45,6.81
  Bottom 0.203: v87.88,8.33 86.56,8.33 IC3.20 | v111.45,6.81 111.45,9.14 R21.2

### Text on the board
_bsilk: v10-14 | BI10-2x5RGB-SE-VC | SKAARHOJ 2014 | GITHUB: SKAARHOJ-Open-Engineering